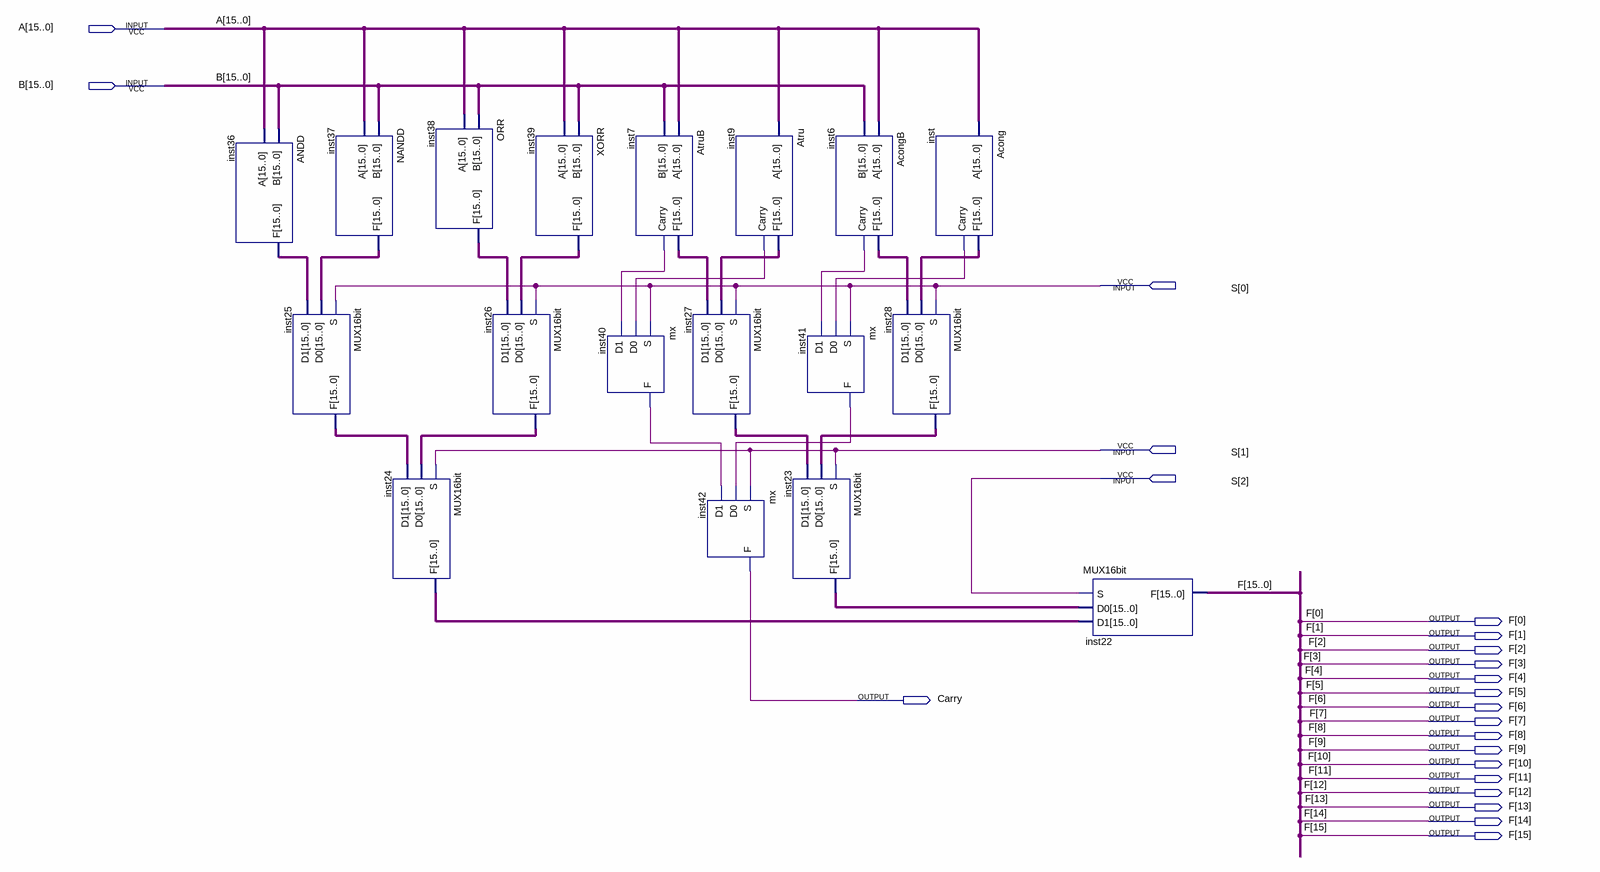
[diagram p0: schematic sheet]
// Quartus schematic Lab03_21522233.bdf as structural Verilog: 18 symbols, 22 pins
module Lab03_21522233 (
  input  [15:0] A,
  input  [15:0] B,
  input  [2:0] S,
  output [15:0] F,
  output Carry
);

  wire inst6_carry, inst7_carry, inst9_carry, inst40_f, inst41_f, inst_carry;
  wire [15:0] inst6_f, inst7_f, inst9_f, inst23_f, inst24_f, inst25_f, inst26_f, inst27_f, inst28_f,
       inst36_f, inst37_f, inst38_f, inst39_f, inst_f;

  ANDD inst36 (.B(B), .A(A), .F(inst36_f));
  NANDD inst37 (.B(B), .A(A), .F(inst37_f));
  MUX16bit inst25 (.S(S[0]), .D0(inst37_f), .D1(inst36_f), .F(inst25_f));
  MUX16bit inst24 (.S(S[1]), .D0(inst26_f), .D1(inst25_f), .F(inst24_f));
  ORR inst38 (.B(B), .A(A), .F(inst38_f));
  MUX16bit inst26 (.S(S[0]), .D0(inst39_f), .D1(inst38_f), .F(inst26_f));
  XORR inst39 (.B(B), .A(A), .F(inst39_f));
  mx inst40 (.S(S[0]), .D0(inst9_carry), .D1(inst7_carry), .F(inst40_f));
  AtruB inst7 (.A(A), .B(B), .F(inst7_f), .Carry(inst7_carry));
  Atru inst9 (.A(A), .F(inst9_f), .Carry(inst9_carry));
  MUX16bit inst27 (.S(S[0]), .D0(inst9_f), .D1(inst7_f), .F(inst27_f));
  mx inst42 (.S(S[1]), .D0(inst41_f), .D1(inst40_f), .F(Carry));
  MUX16bit inst23 (.S(S[1]), .D0(inst28_f), .D1(inst27_f), .F(inst23_f));
  AcongB inst6 (.A(A), .B(B), .F(inst6_f), .Carry(inst6_carry));
  mx inst41 (.S(S[0]), .D0(inst_carry), .D1(inst6_carry), .F(inst41_f));
  MUX16bit inst28 (.S(S[0]), .D0(inst_f), .D1(inst6_f), .F(inst28_f));
  Acong inst (.A(A), .F(inst_f), .Carry(inst_carry));
  MUX16bit inst22 (.S(S[2]), .D0(inst23_f), .D1(inst24_f), .F(F));
endmodule
